# EAGLE design ESP32-Proto3-B (EAGLE 9.6.2)
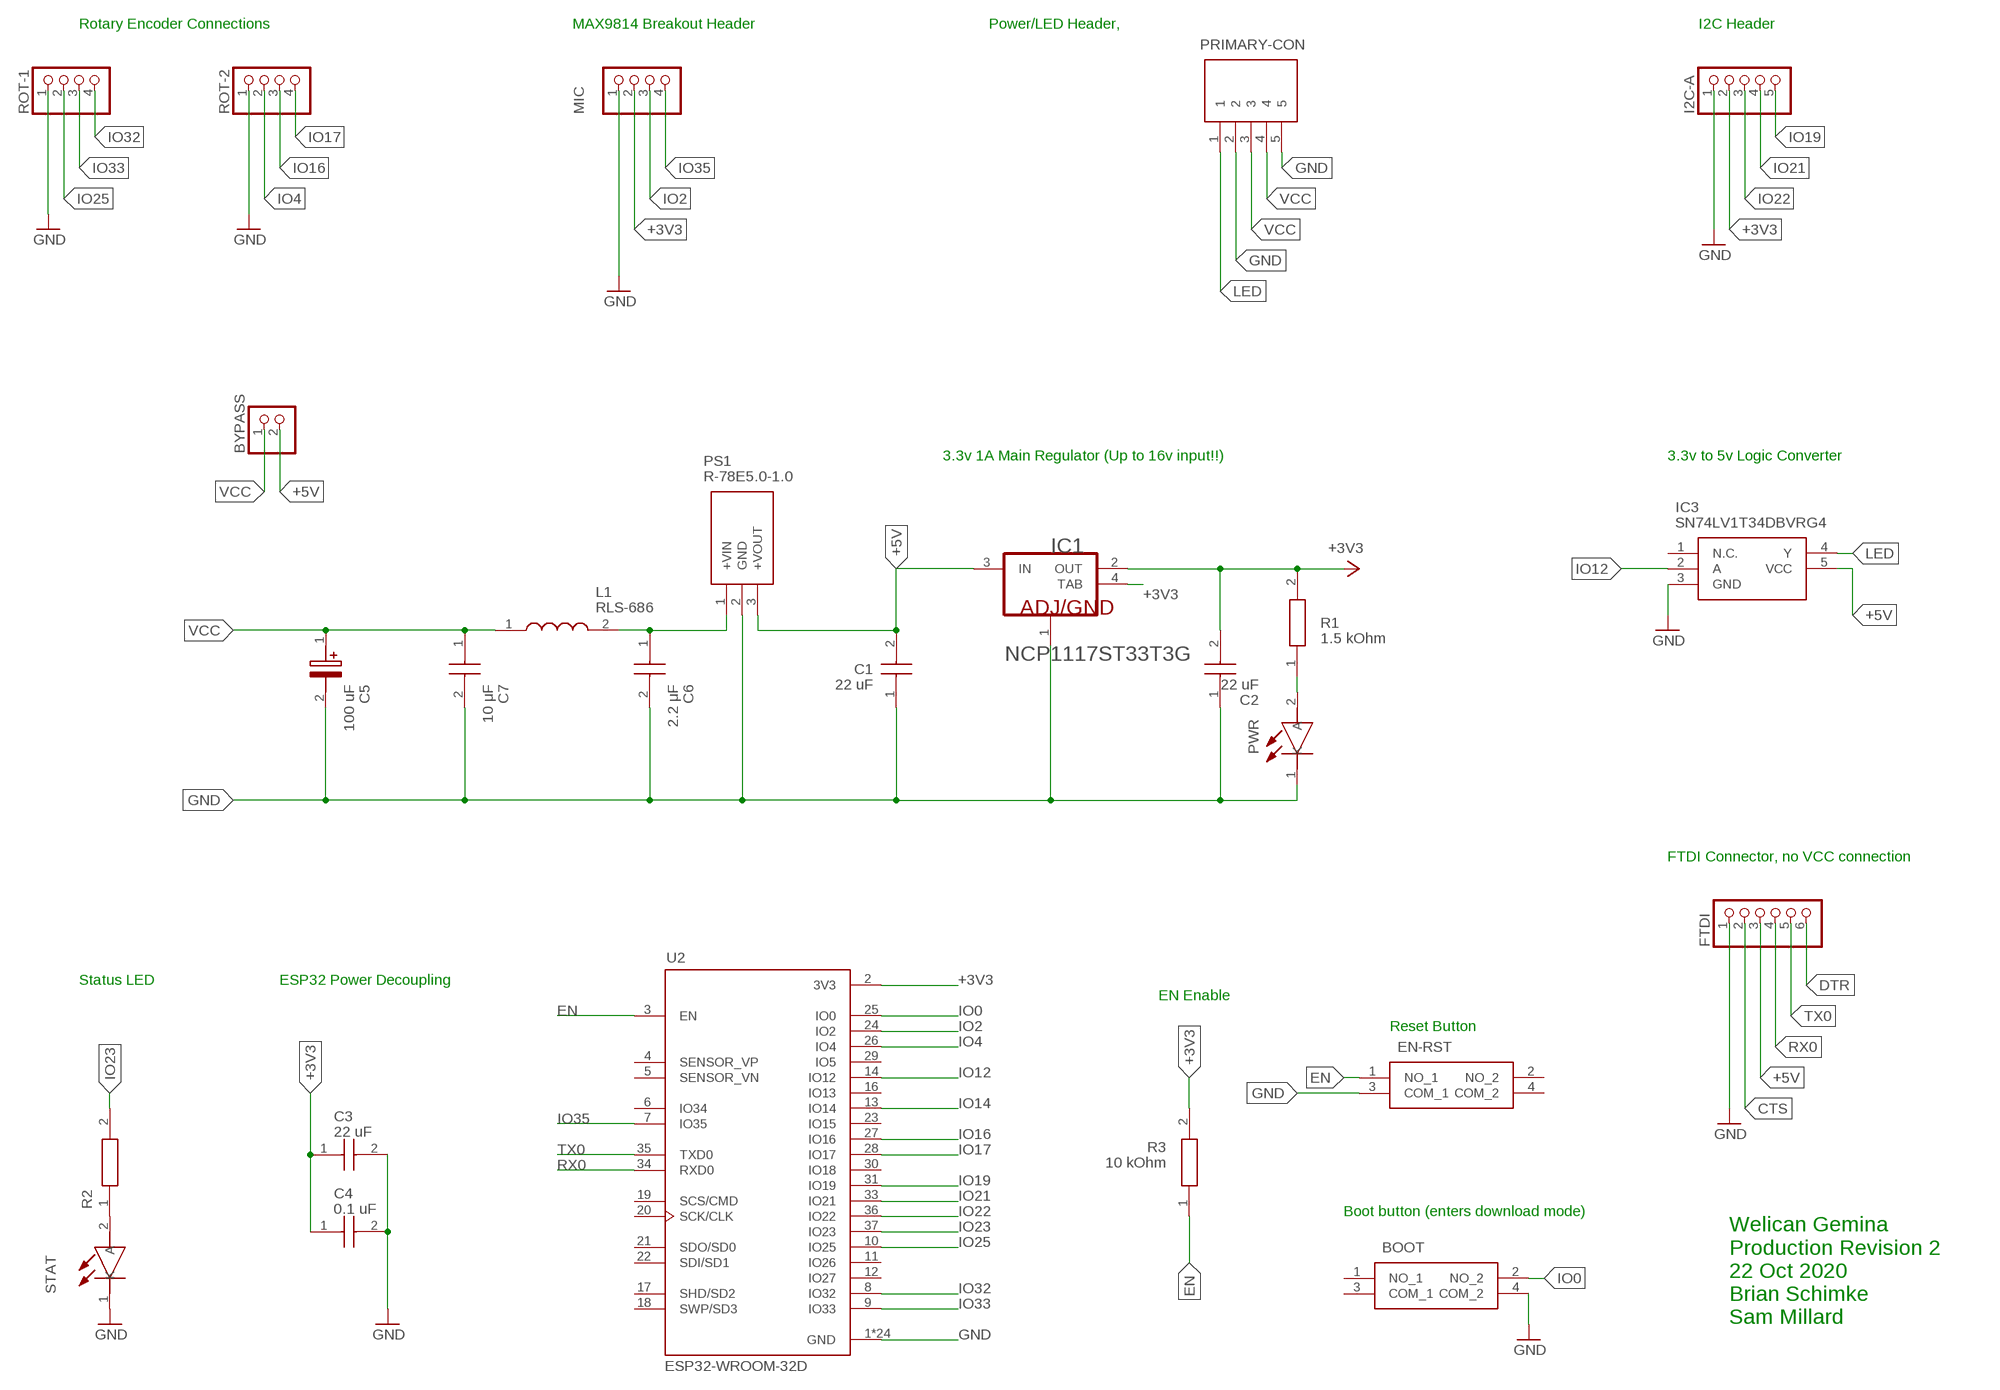
[diagram p0: schematic, sheet 1]

## Parts
BOOT  PTS647SK70SMTR2LFS  [PTS647SK70SMTR2LFS]
BYPASS  PINHD-1X2  [1X02]
C1  22 uF  C1206C226M4PACTU  [CAPC3216X180N]
C2  22 uF  C1206C226M4PACTU  [CAPC3216X180N]
C3  22 uF  C1206C226M4PACTU  [CAPC3216X180N]
C4  0.1 uF  C1206C226M4PACTU  [CAPC3216X180N]
C5  100 uF  865080445010  [CAPAE660X770N]
C6  2.2 μF  C1206C226M4PACTU  [CAPC3216X180N]
C7  10 μF  C1206C226M4PACTU  [CAPC3216X180N]
EN-RST  PTS647SK70SMTR2LFS  [PTS647SK70SMTR2LFS]
FTDI  PINHD-1X6  [1X06]
I2C-A  PINHD-1X5  [1X05]
IC1  ON_SEMICONDUCTOR_NCP1117ST33T3GON_SEMICONDUCTOR_NCP1117ST33T3G_0_0  [ON_SEMICONDUCTOR_NCP1117ST33T3G_0]
IC3  SN74LV1T34DBVRG4  [SOT95P280X145-5N]
L1  RLS-686  [RLS686]
MIC  PINHD-1X4  [1X04]
PRIMARY-CON  1984646  [1984646]
PS1  R-78E5.0-1.0  [R78E5010]
PWR  150120AS75000  [LEDSC320X160X78-2N]
R1  1.5 kOhm  CRCW12061K00FKEB  [RESC3216X60N]
R2  CRCW12061K00FKEB  [RESC3216X60N]
R3  10 kOhm  CRCW12061K00FKEB  [RESC3216X60N]
ROT-1  PINHD-1X4  [1X04]
ROT-2  PINHD-1X4  [1X04]
STAT  150120AS75000  [LEDSC320X160X78-2N]
U2  ESP32-WROOM-32D  [MODULE_ESP32-WROOM-32D]

## Nets
+3V3: C2.2 C3.1 C4.1 I2C-A.2 IC1.2(OUT) IC1.4(TAB) MIC.2 R1.2 R3.2 U2.2(3V3)
+5V: BYPASS.2 C1.2 FTDI.3 IC1.3(IN) IC3.5(VCC) PS1.3(+VOUT)
CTS: FTDI.2
DTR: FTDI.6
EN: EN-RST.1(NO_1) R3.1 U2.3(EN)
GND: BOOT.4(COM_2) C1.1 C2.1 C3.2 C4.2 C5.2(-) C6.2 C7.2 EN-RST.3(COM_1) FTDI.1 I2C-A.1 IC1.1(ADJ/GND) IC3.3(GND) MIC.1 PRIMARY-CON.2 PRIMARY-CON.5 PS1.2(GND) PWR.1(K) ROT-1.1 ROT-2.1 STAT.1(K) U2.1(GND) U2.15(GND) U2.38(GND) U2.39_1(GND) U2.39_2(GND) U2.39_3(GND) U2.39_4(GND) U2.39_5(GND) U2.39_6(GND) U2.39_7(GND) U2.39_8(GND) U2.39_9(GND) U2.39_10(GND) U2.39_11(GND) U2.39_12(GND) U2.39_13(GND) U2.39_14(GND) U2.39_15(GND) U2.39_16(GND) U2.39_17(GND) U2.39_18(GND) U2.39_19(GND) U2.39_20(GND) U2.39_21(GND)
IO0: BOOT.2(NO_2) U2.25(IO0)
IO2: MIC.3 U2.24(IO2)
IO4: ROT-2.2 U2.26(IO4)
IO12: IC3.2(A) U2.14(IO12)
IO14: U2.13(IO14)
IO16: ROT-2.3 U2.27(IO16)
IO17: ROT-2.4 U2.28(IO17)
IO19: I2C-A.5 U2.31(IO19)
IO21: I2C-A.4 U2.33(IO21)
IO22: I2C-A.3 U2.36(IO22)
IO23: R2.2 U2.37(IO23)
IO25: ROT-1.2 U2.10(IO25)
IO32: ROT-1.4 U2.8(IO32)
IO33: ROT-1.3 U2.9(IO33)
IO35: MIC.4 U2.7(IO35)
LED: IC3.4(Y) PRIMARY-CON.1
N$1: PWR.2(A) R1.1
N$2: R2.1 STAT.2(A)
RX0: FTDI.4 U2.34(RXD0)
TX0: FTDI.5 U2.35(TXD0)
VCC: BYPASS.1 C5.1(+) C7.1 L1.1 PRIMARY-CON.3 PRIMARY-CON.4
VIN: C6.1 L1.2 PS1.1(+VIN)
Unconnected: BOOT.1(NO_1) BOOT.3(COM_1) EN-RST.2(NO_2) EN-RST.4(COM_2) IC3.1(N.C.) U2.4(SENSOR_VP) U2.5(SENSOR_VN) U2.6(IO34) U2.11(IO26) U2.12(IO27) U2.16(IO13) U2.17(SHD/SD2) U2.18(SWP/SD3) U2.19(SCS/CMD) U2.20(SCK/CLK) U2.21(SDO/SD0) U2.22(SDI/SD1) U2.23(IO15) U2.29(IO5) U2.30(IO18)

## Notes on the sheet
- Rotary Encoder Connections | MAX9814 Breakout Header | Power/LED Header, | I2C Header
- 3.3v 1A Main Regulator (Up to 16v input!!) | 3.3v to 5v Logic Converter
- FTDI Connector, no VCC connection
- Status LED | ESP32 Power Decoupling
- EN Enable
- Reset Button
- Boot button (enters download mode)
- Welican Gemina
  Production Revision 2
  22 Oct 2020
  Brian Schimke
  Sam Millard

## Library data of the parts
BOOT EN-RST = SamacSys_Parts:PTS647SK70SMTR2LFS: Tactile Switches 50mA 12VDC, 2.5N 7.0mm H, G leads Source: Datasheet <https:////www.ckswitches.com/media/2567/pts647.pdf>; DESCRIPTION: Tactile Switches 50mA 12VDC, 2.5N 7.0mm H, G leads; HEIGHT: 7.2mm; MANUFACTURER_NAME: C & K COMPONENTS; MANUFACTURER_PART_NUMBER: PTS647SK70SMTR2LFS; MOUSER_PART_NUMBER: 611-PTS647SK70SMTR2L; MOUSER_PRICE-STOCK: https://www.mouser.co.uk/ProductDetail/CK/PTS647SK70SMTR2LFS?qs=PqoDHHvF64%2FG2CdR6DYUFw%3D%3D
BYPASS = pinhead:PINHD-1X2: PIN HEADER
C1-C4 C6 C7 = SamacSys_Parts:C1206C226M4PACTU: KEMET 1206 (3216M) 22uF MLCC 16V dc +/-20% SMD C1206C226M4PACTU Source: Datasheet <https://api.kemet.com/component-edge/download/specsheet/C1206C226M4PACTU.pdf>; DESCRIPTION: KEMET 1206 (3216M) 22uF MLCC 16V dc +/-20% SMD C1206C226M4PACTU; HEIGHT: 1.8mm; MANUFACTURER_NAME: Kemet; MANUFACTURER_PART_NUMBER: C1206C226M4PACTU; MOUSER_PART_NUMBER: 80-C1206C226M4P; MOUSER_PRICE-STOCK: https://www.mouser.co.uk/ProductDetail/KEMET/C1206C226M4PACTU?qs=vBH1GPjCw2UZFSd%252B4IU1Qg%3D%3D
C5 = SamacSys_Parts:865080445010: Wurth Elektronik Aluminium Electrolytic Capacitor 100uF 25V dc 6.3mm V-Chip WCAP-ASLI Series Aluminium, Surface Mount Source: Datasheet <https://katalog.we-online.com/pbs/datasheet/865080445010.pdf>; DESCRIPTION: Wurth Elektronik Aluminium Electrolytic Capacitor 100uF 25V dc 6.3mm V-Chip WCAP-ASLI Series Aluminium, Surface Mount; HEIGHT: 7.7mm; MANUFACTURER_NAME: Wurth Elektronik; MANUFACTURER_PART_NUMBER: 865080445010; MOUSER_PART_NUMBER: 710-865080445010; MOUSER_PRICE-STOCK: https://www.mouser.co.uk/ProductDetail/Wurth-Elektronik/865080445010?qs=0KOYDY2FL29KjsP7WHszFQ%3D%3D
FTDI = pinhead:PINHD-1X6: PIN HEADER
I2C-A = pinhead:PINHD-1X5: PIN HEADER
IC1 = ON Semiconductor - NCP1117ST33T3G:ON_SEMICONDUCTOR_NCP1117ST33T3G: ONSC-NCP1117-SOT223-4; CASE_CODE_IMPERIAL: 0603; CASE_CODE_METRIC: 1608; CASE_PACKAGE: 0603; CIIVA_IDS: 19354120; COMPONENT_LINK_1_DESCRIPTION: Manufacturer URL; COMPONENT_LINK_1_URL: http://www.onsemi.com/; DATASHEET: http://www.onsemi.com/pub_link/Collateral/NCP1117-D.PDF; DATASHEET_VERSION: Rev. 27, 09/2014; FOOTPRINT_VARIANT_NAME_0: Manufacturer Recommended; HEIGHT: 0.45 mm; IMPORTED: yes; IMPORTED_FROM: vault; IMPORT_TS: 1521845423; LENGTH: 1.55 mm; MAX_OPERATING_TEMPERATURE: 155 degC; MF: ON Semiconductor; MIN_OPERATING_TEMPERATURE: -55 degC; MOUNT: Surface Mount; MPN: NCP1117ST33T3G; PACKAGE: SOT-223-4-318H-01_A; PACKAGE_DESCRIPTION: 4-Pin Small Outline Transistor, Body 6.5 x 3.5 mm, Pitch 2.3 mm; PACKAGE_QUANTITY: 5000; PACKAGING: Tape and Reel; POWER_RATING: 100 mW; PREFIX: U; RADIATION_HARDENING: No; REACH_SVHC: Unknown; RELEASE_DATE: 1475065185; RESISTANCE: 220 kohm; RO_HSCOMPLIANT: true; TOLERANCE: 1%; TYPE_RESISTOR: Thick Film; VAULT_GUID: C6E429D0-32F2-4CA3-9C68-29F3FC9DADEB; VAULT_REVISION: 6AD56B9F-4B97-41F2-91E8-97C557B92B31; VOLTAGE_RATING: 75 V; WEIGHT: 7.1E-05 oz; WIDTH: 0.85 mm
IC3 = SamacSys_Parts:SN74LV1T34DBVRG4: Single Power Supply BUFFER Logic Level Shifter (no enable) Source: Datasheet <http://www.ti.com/lit/gpn/sn74lv1t34>; DESCRIPTION: Single Power Supply BUFFER Logic Level Shifter (no enable); HEIGHT: 1.45mm; MANUFACTURER_NAME: Texas Instruments; MANUFACTURER_PART_NUMBER: SN74LV1T34DBVRG4; MOUSER_PART_NUMBER: 595-SN74LV1T34DBVRG4; MOUSER_PRICE-STOCK: https://www.mouser.co.uk/ProductDetail/Texas-Instruments/SN74LV1T34DBVRG4?qs=vdi0iO8H4N10R%252Bt%252BjmxZrg%3D%3D
L1 = SamacSys_Parts:RLS-686: Fixed Inductors Line Inductors for RECOM Power Supply Source: Datasheet <https://componentsearchengine.com/Datasheets/1/RLS-686.pdf>; DESCRIPTION: Fixed Inductors Line Inductors for RECOM Power Supply; HEIGHT: 5.5mm; MANUFACTURER_NAME: RECOM Power; MANUFACTURER_PART_NUMBER: RLS-686; MOUSER_PART_NUMBER: 919-RLS-686; MOUSER_PRICE-STOCK: https://www.mouser.co.uk/ProductDetail/RECOM-Power/RLS-686?qs=gZXFycFWdAPkuw4EqL4CBw%3D%3D
MIC ROT-1 ROT-2 = pinhead:PINHD-1X4: PIN HEADER
PRIMARY-CON = SamacSys_Parts:1984646: Phoenix Contact, COMBICON PT 3.5mm Pitch, 5 Way PCB Terminal Strip Source: Datasheet <https://www.phoenixcontact.com/online/portal/in?uri=pxc-oc-itemdetail:pid=1984646&library=inen&tab=1>; DESCRIPTION: Phoenix Contact, COMBICON PT 3.5mm Pitch, 5 Way PCB Terminal Strip; HEIGHT: 9.3mm; MANUFACTURER_NAME: Phoenix Contact; MANUFACTURER_PART_NUMBER: 1984646
PS1 = SamacSys_Parts:R-78E5.0-1.0: Non-Isolated DC/DC Converters 8-28Vin 5V 1.0A THRU Source: Datasheet <http://www.recom-power.com/pdf/Innoline/R-78Exx-1.0.pdf>; DESCRIPTION: Non-Isolated DC/DC Converters 8-28Vin 5V 1.0A THRU; HEIGHT: 10.4mm; MANUFACTURER_NAME: RECOM Power; MANUFACTURER_PART_NUMBER: R-78E5.0-1.0; MOUSER_PART_NUMBER: 919-R-78E5.0-1.0; MOUSER_PRICE-STOCK: https://www.mouser.co.uk/ProductDetail/RECOM-Power/R-78E50-10?qs=T0XSgvH75d4EsZCU9I5HVA%3D%3D
PWR STAT = SamacSys_Parts:150120AS75000: WL-SMCW SMD chip LED top view monocolor%D waterclear Source: Datasheet <http://katalog.we-online.com/led/datasheet/150120AS75000.pdf>; DESCRIPTION: WL-SMCW SMD chip LED top view monocolor%D waterclear; HEIGHT: mm; MANUFACTURER_NAME: Wurth Elektronik; MANUFACTURER_PART_NUMBER: 150120AS75000; MOUSER_PART_NUMBER: 710-150120AS75000; MOUSER_PRICE-STOCK: https://www.mouser.co.uk/ProductDetail/Wurth-Elektronik/150120AS75000?qs=LlUlMxKIyB3dthGDbNsiXQ%3D%3D
R1-R3 = SamacSys_Parts:CRCW12061K00FKEB: Thick Film Resistors - SMD 1/4watt 1Kohms 1% Source: Datasheet <http://www.vishay.com/docs/20035/dcrcwe3.pdf>; DESCRIPTION: Thick Film Resistors - SMD 1/4watt 1Kohms 1%; HEIGHT: 0.6mm; MANUFACTURER_NAME: Vishay; MANUFACTURER_PART_NUMBER: CRCW12061K00FKEB; MOUSER_PART_NUMBER: 71-CRCW12061K00FKEB; MOUSER_PRICE-STOCK: https://www.mouser.co.uk/ProductDetail/Vishay-Dale/CRCW12061K00FKEB?qs=3XLFQ9LoC1wOYUVdt2fbOg%3D%3D
U2 = ESP32-WROOM-32D:ESP32-WROOM-32D: Bluetooth, WiFi 802.11b/g/n, Bluetooth v4.2 + EDR, Class 1, 2 and 3 Transceiver Module 2.4GHz ~ 2.5GHz Integrated, Trace Surface Mount Check prices <https://pricing.snapeda.com/search/part/ESP32-WROOM-32D/?ref=eda>; AVAILABILITY: Bad; DESCRIPTION: Bluetooth, WiFi 802.11b/g/n, Bluetooth v4.2 +EDR, Class 1, 2 and 3 Transceiver Module 2.4GHz ~ 2.5GHz Integrated, Trace Surface Mount; MF: Espressif Systems; MP: ESP32-WROOM-32D; PACKAGE: Module Espressif Systems; PRICE: None

## Board
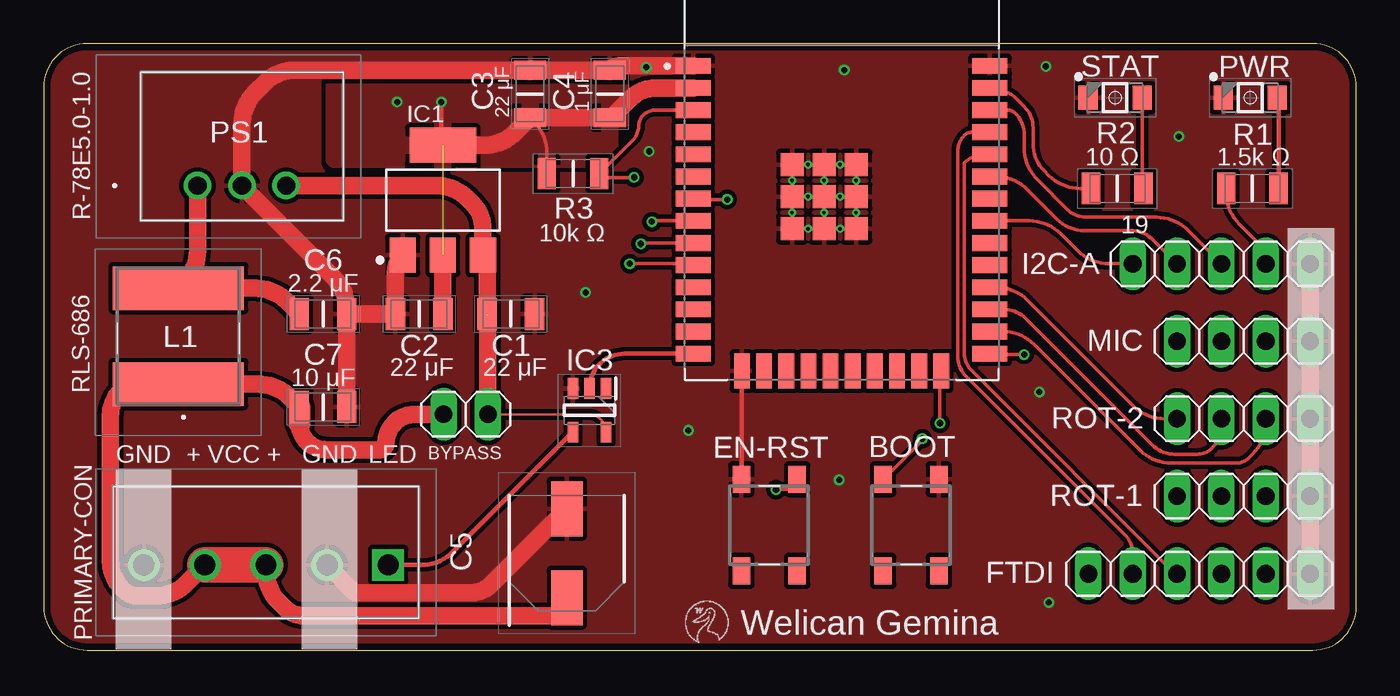
[diagram p1: board, top side]
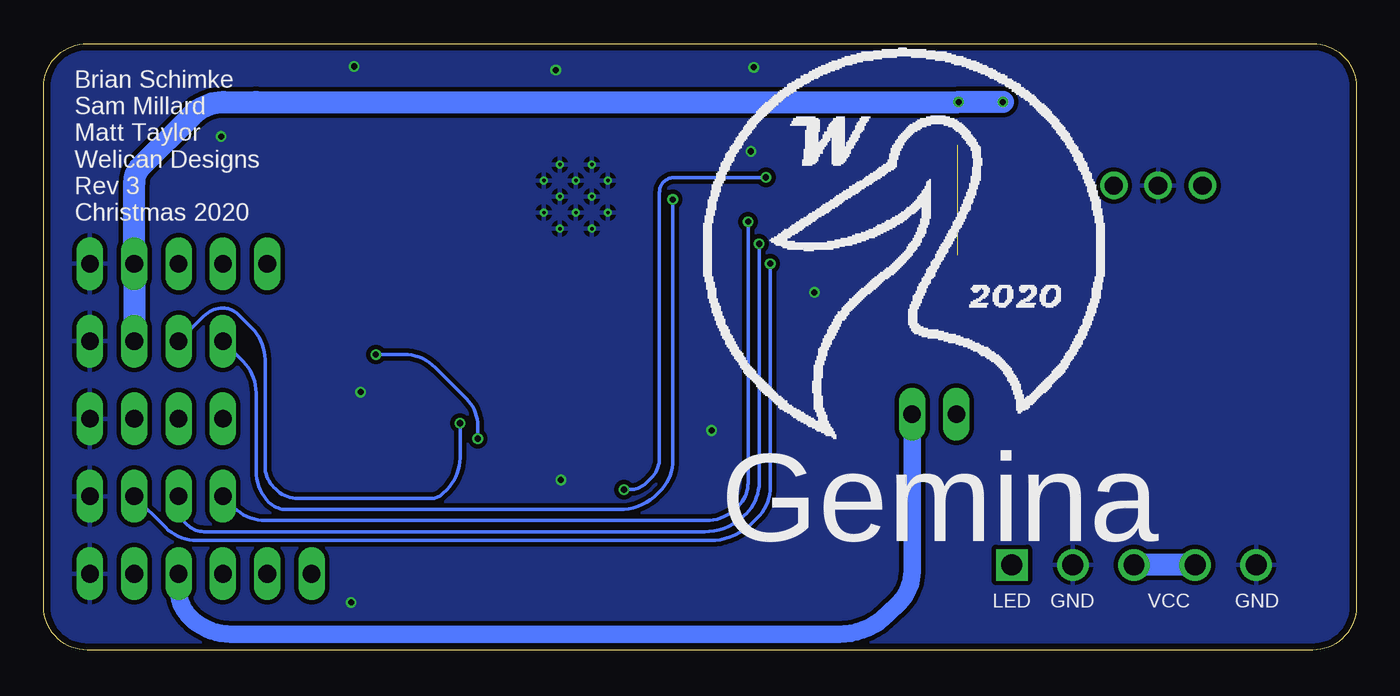
[diagram p2: board, bottom side, seen from below]

Size 75.23 x 34.79 mm. Coordinates in mm from the lower left corner, seen from the top.
Outline: 75.23,2.5 75.23,32.29 arc90 72.73,34.79 2.5,34.79 arc90 0,32.29 0,2.5 arc90 2.5,0 72.73,0 arc90 75.23,2.5
Copper layers (1*16): Top 0.035559375mm / dielectric 1.6mm / Bottom 0.035559375mm
Design rules "oshpark-2layer": minimum track width 6mil, minimum drill 10mil, track to track 6mil, track to pad 6mil, pad to pad 6mil, via to via 6mil, smd to smd 6mil, copper to edge 15mil, drill to drill 6mil, minimum pad ring 5mil, minimum via ring 5mil, stop-mask expansion 2.5mil, vias tented up to drill 0mil, thermal gap 10mil

### Footprints (pad centres in the part's own frame; a part is rotated, then mirrored left to right if it is on the bottom)
PTS647SK70SMTR2LFS = smd 1.55 x 1: 1 -2.625,1.6; 2 2.625,1.6; 3 -2.625,-1.6; 4 2.625,-1.6
1X02 = drill 1.016 long: 1 -1.27,0; 2 1.27,0
CAPC3216X180N = smd 1.1 x 1.82: 1 -1.36,0; 2 1.36,0
CAPAE660X770N = smd 3.15 x 1.8: 1 -2.55,0; 2 2.55,0
1X06 = drill 1.016 long: 1 -6.35,0; 2 -3.81,0; 3 -1.27,0; 4 1.27,0; 5 3.81,0; 6 6.35,0
1X05 = drill 1.016 long: 1 -5.08,0; 2 -2.54,0; 3 0,0; 4 2.54,0; 5 5.08,0
ON_SEMICONDUCTOR_NCP1117ST33T3G_0 = smd 2 x 1.5: 1 -3.15,2.3; 2 -3.15,0; 3 -3.15,-2.3 | smd 2 x 3.8: 4 3.15,0
SOT95P280X145-5N = smd 1.2 x 0.6: 1 -1.25,0.95; 2 -1.25,0; 3 -1.25,-0.95; 4 1.25,-0.95; 5 1.25,0.95
RLS686 = smd 2.5 x 7.5: 1 -2.75,0; 2 2.75,0
1X04 = drill 1.016 long: 1 -3.81,0; 2 -1.27,0; 3 1.27,0; 4 3.81,0
1984646 = drill 1.2 pad 1.8 square: 1 0,0 | drill 1.2 pad 1.8: 2 3.5,0; 3 7,0; 4 10.5,0; 5 14,0
R78E5010 = drill 1.05 pad 1.575: 1 0,0; 2 2.54,0; 3 5.08,0
LEDSC320X160X78-2N = smd 1.1 x 1.4: 1 -1.55,0; 2 1.55,0
RESC3216X60N = smd 1.05 x 1.8: 1 -1.5,0; 2 1.5,0
MODULE_ESP32-WROOM-32D = smd 2 x 0.9: 1 -8.5,5.26; 2 -8.5,3.99; 3 -8.5,2.72; 4 -8.5,1.45; 5 -8.5,0.18; 6 -8.5,-1.09; 7 -8.5,-2.36; 8 -8.5,-3.63; 9 -8.5,-4.9; 10 -8.5,-6.17; 11 -8.5,-7.44; 12 -8.5,-8.71; 13 -8.5,-9.98; 14 -8.5,-11.25; 25 8.5,-11.25; 26 8.5,-9.98; 27 8.5,-8.71; 28 8.5,-7.44; 29 8.5,-6.17; 30 8.5,-4.9; 31 8.5,-3.63; 32 8.5,-2.36; 33 8.5,-1.09; 34 8.5,0.18; 35 8.5,1.45; 36 8.5,2.72; 37 8.5,3.99; 38 8.5,5.26 | smd 0.9 x 2: 15 -5.715,-12.25; 16 -4.445,-12.25; 17 -3.175,-12.25; 18 -1.905,-12.25; 19 -0.635,-12.25; 20 0.635,-12.25; 21 1.905,-12.25; 22 3.175,-12.25; 23 4.445,-12.25; 24 5.715,-12.25 | smd 1.33 x 1.33: 39_1 -2.835,-0.405; 39_2 -1,-0.405; 39_3 0.835,-0.405; 39_4 -2.835,-2.24; 39_5 -1,-2.24; 39_6 0.835,-2.24; 39_7 -2.835,-4.075; 39_8 -1,-4.075; 39_9 0.835,-4.075 | drill 0.2 pad 0.3: 39_10 -1.917,-0.405; 39_11 -0.083,-0.405; 39_12 -2.835,-1.323; 39_13 -1,-1.323; 39_14 0.835,-1.323; 39_15 -1.917,-2.24; 39_16 -0.083,-2.24; 39_17 -2.835,-3.158; 39_18 -1,-3.158; 39_19 0.835,-3.158; 39_20 -1.917,-4.075; 39_21 -0.083,-4.075

### Placement (x,y rotation side)
BOOT  49.71,7.17 90 top
BYPASS  24.19,13.53 0 top
C1  26.78,19.28 180 top
C2  21.53,19.28 0 top
C3  27.88,31.9 90 top
C4  32.45,31.9 90 top
C5  29.99,5.56 90 top
C6  16.02,19.28 0 top
C7  16.02,13.95 0 top
EN-RST  41.59,7.17 270 top
FTDI  66.23,4.38 180 top
I2C-A  67.5,22.16 180 top
IC1  22.88,25.8 90 top
IC3  31.28,13.75 270 top
L1  7.72,18.01 90 top
MIC  68.77,17.72 180 top
PRIMARY-CON  19.74,4.89 180 top
PS1  8.82,26.64 0 top
PWR  69.15,31.69 0 top
R1  69.28,26.48 180 top
R2  61.53,26.48 180 top
R3  30.34,27.33 180 top
ROT-1  68.77,8.83 180 top
ROT-2  68.77,13.27 180 top
STAT  61.4,31.69 0 top
U2  45.73,28.25 0 top

### Tracks (layer width: path | path; a pad name or v marks a point on that pad's centre or on a via)
+3V3  (via drill 0.35)  (1 unrouted)
  Top 0.203: I2C-A.2 arc45 69.5,23.46 68.52,24.44 arc-45 67.78,26.24 R1.2 | C3.1 28.1,30.32 arc-45 28.84,28.52 R3.2
  Top 0.254: v22.8,31.43 22.8,29.16 arc45 IC1.4
  Top 1.016: C2.2 22.89,22.64 arc45 IC1.2 | IC1.4 25.24,28.95 arc45 27.03,29.7 C3.1 C4.1 arc45 32.58,30.59 33.63,31.64 arc-45 35.08,32.24 U2.2
  Bottom 1.27: MIC.2 I2C-A.2 70.04,26.83 arc45 69.66,27.75 66.72,30.69 arc45 64.92,31.43 63.06,31.43 v22.8,31.43 v20.26,31.43
  pour Top (isolate 0.254): 33.08,28.17 33.08,32.36 16.65,32.36 16.65,28.17
+5V  (1 unrouted)
  Top 0.152: IC3.5 arc90 31.21,13.53 BYPASS.2
  Top 1.016: PS1.3 22.5,26.64 arc-45 24.3,25.9 24.57,25.63 arc-45 25.18,24.15 IC1.3 | 25.42,22.09 arc45 IC1.3 | C1.2 25.42,22.42 arc90 IC1.3 | BYPASS.2 25.46,19.24
  Bottom 1.016: FTDI.3 67.5,3.48 arc-45 66.84,1.89 arc-45 64.49,0.91 29.67,0.91 arc-45 26.85,2.08 26.21,2.72 arc-45 25.46,4.52 BYPASS.2
EN  (via drill 0.35)
  Top 0.203: U2.3 35.08,30.97 arc45 34.35,30.67 arc45 34.1,30.06 34.1,30.04 arc-45 33.78,29.27 R3.1 arc45 32.36,27.11 v33.85,27.11 | v41.97,9.21 42.72,9.21 arc45 43.19,9.67 EN-RST.1
  Bottom 0.203: v33.85,27.11 39.07,27.11 arc-45 39.69,26.86 arc-45 39.94,26.25 39.94,11.04 arc45 40.43,9.86 40.7,9.59 arc45 41.62,9.21 v41.97,9.21
GND  (via drill 0.35)
  Top 0.254: U2.15 40.02,9.88 arc45 EN-RST.3
  Top 1.016: C5.2 25.64,3.77 arc-45 24.46,3.28 17.94,3.28 arc-45 17.79,3.34 PRIMARY-CON.2 | C7.2 C6.2 | C6.2 arc45 C6.2 | C6.2 20.16,19.28 arc45 C2.1 20.17,21.65 arc-45 IC1.1 | C6.2 17.38,19.58 arc45 16.63,21.37 PS1.2 11.36,30.16 arc-45 12.11,31.96 12.72,32.57 arc-45 14.38,33.26 C3.2 C4.2 arc-45 33.06,33.51 U2.1 | FTDI.1 ROT-1.1 ROT-2.1 MIC.1 I2C-A.1
  other vias: 31.06,20.52 45.59,9.76 36.95,12.6 57.61,2.73 57.44,33.47 65.06,29.45 57.06,14.8 34.71,28.61 34.54,33.43 45.88,33.26
  pour Top (isolate 0.254, rank 3): 0.83,34.61 75.25,34.61 75.25,0.19 0.44,0.19 0.44,34.23 0.44,34.61
  pour Bottom (isolate 0.254): -0.06,34.61 -0.06,0.06 75.5,0.06 75.5,34.73 -0.06,34.73
IO0  (via drill 0.35)
  Top 0.152: U2.25 54.18,16.94
  Top 0.203: BOOT.2 50.29,11.98 arc45 v50.36,12.13 | v56.2,16.95 54.2,16.95 arc45 54.18,16.94
  Bottom 0.203: v50.36,12.13 50.36,12.88 arc-45 50.99,14.41 52.79,16.21 arc-45 54.58,16.95 v56.2,16.95
IO2  (via drill 0.35)
  Top 0.203: v51.37,13.02 51.37,15.67 arc-45 51.49,15.96
  Top 0.254: 51.49,15.96 U2.24
  Bottom 0.203: MIC.3 66.04,19.17 arc45 64.96,19.62 arc45 64.09,19.26 63.29,18.46 arc45 62.55,16.66 62.55,10.56 arc-45 62.04,9.33 61.94,9.24 arc-45 60.64,8.7 53,8.7 arc-45 52.39,8.95 52.12,9.23 arc-45 51.37,11.02 v51.37,13.02
IO4
  Top 0.203: ROT-2.2 70.04,13.05 arc-45 69.3,11.26 69.02,10.99 arc-45 68.41,10.73 64.62,10.73 arc-45 62.82,11.48 56.77,17.53 arc45 54.97,18.27 U2.26
IO12
  Top 0.254: U2.14 33.28,17 arc90 IC3.2
IO16
  Top 0.203: ROT-2.3 67.5,12.9 arc-45 66.96,11.58 arc-45 66.13,11.24 64.82,11.24 arc-45 63.54,11.77 56.29,19.02 arc45 55.03,19.54 U2.27
IO17
  Top 0.203: ROT-2.4 64.23,13.27 arc-45 62.44,14.02 56.39,20.07 arc45 54.59,20.81 U2.28
IO19
  Top 0.203: I2C-A.5 61.06,22.16 arc-45 59.26,22.91 58.29,23.88 arc45 56.49,24.62 U2.31
IO21
  Top 0.203: I2C-A.4 63.59,23.53 arc45 62.29,24.07 59.64,24.07 arc-45 58.1,24.7 56.39,26.42 arc45 54.59,27.16 U2.33
IO22
  Top 0.203: I2C-A.3 65.58,24.08 arc45 63.78,24.83 59.75,24.83 arc-45 58.67,25.28 56.94,27.01 arc-45 56.2,28.8 56.2,29.57 arc45 55.69,30.8 arc45 55.27,30.97 U2.36
IO23
  Top 0.203: U2.37 arc-45 55.77,31.61 56.2,31.18 arc-45 56.71,29.95 56.71,29.03 arc45 57.34,27.5 57.61,27.22 arc45 59.41,26.48 R2.2
IO25  (via drill 0.35)
  Top 0.203: v33.59,22.16 37.04,22.16 arc-45 U2.10
  Bottom 0.203: ROT-1.2 68.24,7.03 arc-45 66.45,6.29 37.06,6.29 arc-45 34.61,7.3 34.34,7.57 arc-45 33.59,9.37 v33.59,22.16
IO32  (via drill 0.35)
  Top 0.203: v34.86,24.57 arc-45 34.98,24.62 U2.8
  Bottom 0.203: ROT-1.4 64.31,8.17 arc-45 62.51,7.43 37.27,7.43 arc-45 35.54,8.15 35.41,8.28 arc-45 34.86,9.6 v34.86,24.57
IO33  (via drill 0.35)
  Top 0.203: v34.23,23.3 arc-45 34.34,23.35 U2.9
  Bottom 0.203: ROT-1.3 67.5,7.68 67.01,7.19 arc-45 66.05,6.79 37.36,6.79 arc-45 35.05,7.75 34.97,7.83 arc-45 34.23,9.62 v34.23,23.3
IO35  (via drill 0.35)
  Top 0.203: v39.18,25.84 37.35,25.84 arc-45 U2.7
  Bottom 0.203: MIC.4 63.8,16.56 arc45 63.06,14.76 63.06,10.26 arc-45 62.32,8.49 arc-45 61.3,8.06 42.26,8.06 arc-45 40.04,8.98 39.92,9.1 arc-45 39.18,10.89 v39.18,25.84
LED
  Top 0.254: IC3.4 23.46,5.63 arc-45 21.66,4.89 PRIMARY-CON.1
N$1
  Top 0.254: R1.1 70.78,31.61 arc90 PWR.2
N$2
  Top 0.203: STAT.2 62.95,26.48 R2.1
N$3
  Bottom 1.27: 9.26,4.89 12.69,4.89
RX0
  Top 0.203: FTDI.4 64.83,4.38 53.19,16.03 arc-45 52.77,17.04 52.77,27.95 arc-45 53.93,28.43 U2.34
TX0
  Top 0.203: FTDI.5 62.42,5.57 arc45 62,6.58 52.87,15.71 arc-45 52.39,16.88 52.39,28.61 arc-45 52.77,29.53 arc-45 53.19,29.7 U2.35
VCC
  Top 1.016: PRIMARY-CON.3 12.74,4.56 arc45 13.49,2.76 13.82,2.43 arc45 14.94,1.97 29.58,1.97 arc45 29.99,2.95 C5.1 | C7.1 14.09,14.52 arc45 12.29,15.26 L1.1 5.34,15.26 arc45 4.42,14.88 arc45 3.83,13.45 3.83,5.13 arc45 4.48,3.56 4.59,3.44 arc45 5.4,3.11 6.45,3.11 arc45 8.18,3.83 PRIMARY-CON.4 | 14.66,13.03 arc90 16.19,11.49 19.24,11.49 arc90 19.62,11.87 arc-90 21.27,13.53 BYPASS.1
  Top 1.27: C7.1 14.66,13.03
  Top 2.032: PRIMARY-CON.4 PRIMARY-CON.3
VIN
  Top 1.016: C6.1 13.92,20.02 arc45 12.13,20.76 L1.2 8.08,21.12 arc45 8.82,22.91 PS1.1

### Text on the board
bPlace: GND | VCC | GND | LED
tNames: 22 μF | 1 μF | 10 Ω | 1.5k Ω | 19 | 10k Ω | 22 μF | 22 μF | GND | + VCC + | GND | LED | Welican Gemina
bNames: Brian Schimke / Sam Millard / Matt Taylor / Welican Designs / Rev 3 / Christmas 2020 | Gemina